# Altium project PCB_Project.PrjPcb
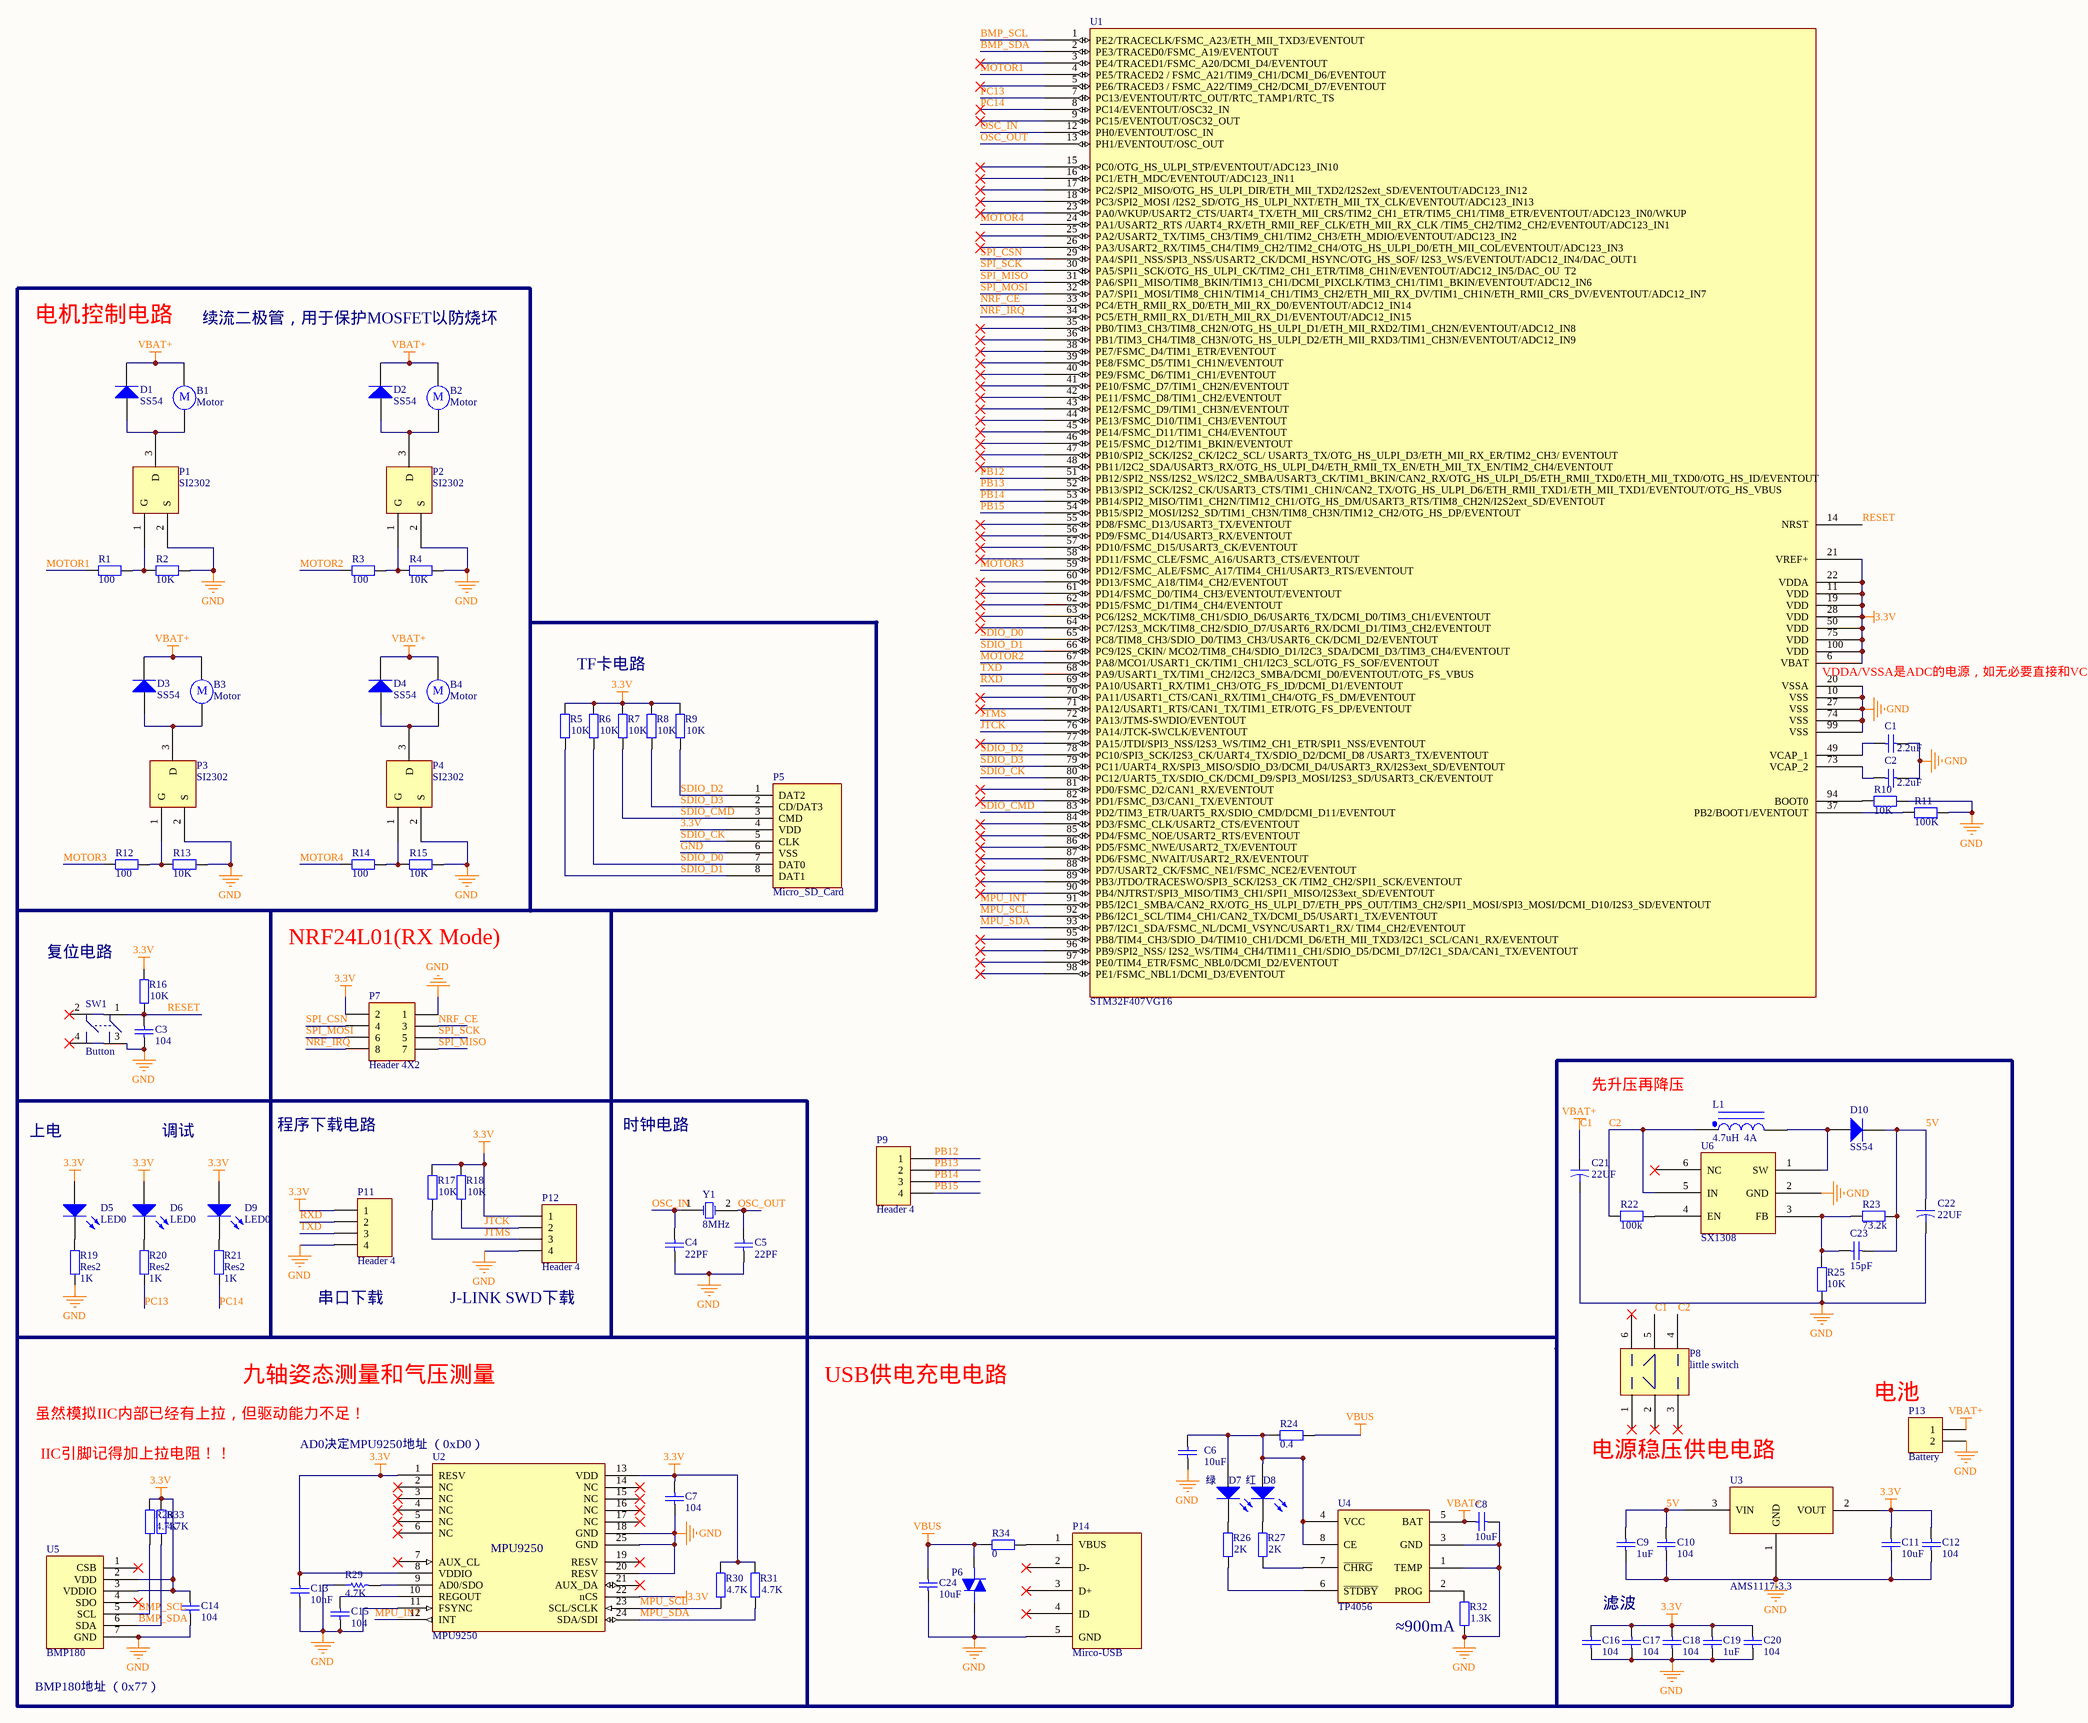
[diagram p0: Sheet1.SchDoc]
1 sheet, 94 parts. Net scope: global (net labels, ports and power ports of the same name join across sheets).
Board files: PCB1.PcbDoc, PCB3.PcbDoc

## Sheet Sheet1.SchDoc
size A2

### Parts
B1  Motor  [BAT-2]
B2  Motor  [BAT-2]
B3  Motor  [BAT-2]
B4  Motor  [BAT-2]
C1  value 2.2uF  [0603]  (hidden comment: Cap)
C2  value 2.2uF  [0603]  (hidden comment: Cap)
C3  value 104  [0603]  (hidden comment: Cap)
C4  value 22PF  [0603]  (hidden comment: Cap)
C5  value 22PF  [0603]  (hidden comment: Cap)
C6  value 10uF  [0603]  (hidden comment: Cap)
C7  value 104  [0603]  (hidden comment: Cap)
C8  value 10uF  [0603]  (hidden comment: Cap)
C9  value 1uF  [0603]  (hidden comment: Cap)
C10  value 104  [0603]  (hidden comment: Cap)
C11  value 10uF  [0603]  (hidden comment: Cap)
C12  value 104  [0603]  (hidden comment: Cap)
C13  value 10nF  [0603]  (hidden comment: Cap)
C14  value 104  [0603]  (hidden comment: Cap)
C15  value 104  [0603]  (hidden comment: Cap)
C16  value 104  [0603]  (hidden comment: Cap)
C17  value 104  [0603]  (hidden comment: Cap)
C18  value 104  [0603]  (hidden comment: Cap)
C19  value 1uF  [0603]  (hidden comment: Cap)
C20  value 104  [0603]  (hidden comment: Cap)
C21  value 22UF  [0603]  (hidden comment: Cap2)
C22  value 22UF  [0603]  (hidden comment: Cap2)
C23  value 15pF  [0603]  (hidden comment: Cap)
C24  value 10uF  [0603]  (hidden comment: Cap)
D1  SS54  [DO-214AA/SMB]
D2  SS54  [DO-214AA/SMB]
D3  SS54  [DO-214AA/SMB]
D4  SS54  [DO-214AA/SMB]
D5  LED0  [0603-LED]
D6  LED0  [0603-LED]
D7  绿  [0603-LED]
D8  红  [0603-LED]
D9  LED0  [0603-LED]
D10  SS54  [DO-214AA/SMB]
L1  value 4.7uH  4A  [0603]  (hidden comment: Inductor Iron Dot)
P1  SI2302  [SOT-23]
P2  SI2302  [SOT-23]
P3  SI2302  [SOT-23]
P4  SI2302  [SOT-23]
P5  Micro_SD_Card  [Micro SD Card]
P6  PESD5V0ST1BA  [0603]  (value not drawn)
P7  Header 4X2  [HDR2X4]
P8  little switch  [little switch]
P9  Header 4  [HDR1X4]
P11  Header 4  [HDR1X4]
P12  Header 4  [HDR1X4]
P13  Battery  [HDR1X2]
P14  Mirco-USB  [microUSB2]
R1  value 100  [0603]  (hidden comment: Res2)
R2  value 10K  [0603]  (hidden comment: Res2)
R3  value 100  [0603]  (hidden comment: Res2)
R4  value 10K  [0603]  (hidden comment: Res2)
R5  value 10K  [0603]  (hidden comment: Res2)
R6  value 10K  [0603]  (hidden comment: Res2)
R7  value 10K  [0603]  (hidden comment: Res2)
R8  value 10K  [0603]  (hidden comment: Res2)
R9  value 10K  [0603]  (hidden comment: Res2)
R10  value 10K  [0603]  (hidden comment: Res2)
R11  value 100K  [0603]  (hidden comment: Res2)
R12  value 100  [0603]  (hidden comment: Res2)
R13  value 10K  [0603]  (hidden comment: Res2)
R14  value 100  [0603]  (hidden comment: Res2)
R15  value 10K  [0603]  (hidden comment: Res2)
R16  value 10K  [0603]  (hidden comment: Res2)
R17  value 10K  [0603]  (hidden comment: Res2)
R18  value 10K  [0603]  (hidden comment: Res2)
R19  Res2  value 1K  [0603]
R20  Res2  value 1K  [0603]
R21  Res2  value 1K  [0603]
R22  value 100k  [0603]  (hidden comment: Res2)
R23  value 73.2k  [0603]  (hidden comment: Res2)
R24  value 0.4  [0603]  (hidden comment: Res2)
R25  value 10K  [0603]  (hidden comment: Res2)
R26  value 2K  [0603]  (hidden comment: Res2)
R27  value 2K  [0603]  (hidden comment: Res2)
R28  value 4.7K  [0603]  (hidden comment: Res2)
R29  value 4.7K  [0603]  (hidden comment: Res1)
R30  value 4.7K  [0603]  (hidden comment: Res2)
R31  value 4.7K  [0603]  (hidden comment: Res2)
R32  value 1.3K  [0603]  (hidden comment: Res2)
R33  value 4.7K  [0603]  (hidden comment: Res2)
R34  value 0  [0603]  (hidden comment: Res2)
SW1  Button  [SMD,5.1x5.1mm - duplicate]
U1  STM32F407VGT6  [LQFP-100]
U2  MPU9250  [QFN24]
U3  AMS1117-3.3  [SOT-223]
U4  TP4056  [SOIC-8/SOP-8]
U5  BMP180  [BMP180]
U6  SX1308  [sot-23-6]
Y1  8MHz  [LC-HC-49S]

### Nets
3.3V: C7.1 C11.2 C12.2 C13.1 C14.1 C16.2 C17.2 C18.2 C19.2 C20.2 D5.1(A) D6.1(A) D9.1(A) P5.4(VDD) P7.2 P11.1 P12.1 R5.2 R6.2 R7.2 R8.2 R9.2 R16.2 R17.2 R18.2 R28.2 R30.2 R31.2 R33.2 U1.6(VBAT) U1.11(VDD) U1.19(VDD) U1.21(VREF+) U1.22(VDDA) U1.28(VDD) U1.50(VDD) U1.75(VDD) U1.100(VDD) U2.1(RESV) U2.8(VDDIO) U2.13(VDD) U2.22(nCS) U3.2(VOUT) U5.2(VDD) U5.3(VDDIO)
C1: B1.1 B2.1 B3.1 B4.1 C8.1 C21.1 D1.2(K) D2.2(K) D3.2(K) D4.2(K) P8.5 P13.1 U4.5(BAT)  [also labelled VBAT+]
GND: C1.2 C2.2 C3.1 C4.1 C5.1 C6.1 C7.2 C8.2 C9.1 C10.1 C11.1 C12.1 C13.2 C14.2 C15.2 C16.1 C17.1 C18.1 C19.1 C20.1 C21.2 C22.2 C24.1 P1.2(S) P2.2(S) P3.2(S) P4.2(S) P5.6(VSS) P6.2(M2) P7.1 P11.4 P12.4 P13.2 P14.5(GND) R2.1 R4.1 R10.1 R11.1 R13.1 R15.1 R19.1 R25.1 R29.1 R32.1 SW1.3 U1.10(VSS) U1.20(VSSA) U1.27(VSS) U1.74(VSS) U1.99(VSS) U2.11(FSYNC) U2.18(GND) U2.20(RESV) U2.25(GND) U3.1(GND) U4.1(TEMP) U4.3(GND) U5.7(GND) U6.2(GND)
VBUS: C24.2 P6.1(M1) R24.1 R34.2
5V: C9.2 C10.2 C22.1 C23.1 D10.2(K) R23.1 U3.3(VIN)
BMP_SCL: R28.1 U1.1(PE2/TRACECLK/FSMC_A23/ETH_MII_TXD3/EVENTOUT) U5.5(SCL)
BMP_SDA: R33.1 U1.2(PE3/TRACED0/FSMC_A19/EVENTOUT) U5.6(SDA)
C2: L1.1 P8.4 R22.2 U6.5(IN)
JTCK: P12.2 R18.1 U1.76(PA14/JTCK-SWCLK/EVENTOUT)
JTMS: P12.3 R17.1 U1.72(PA13/JTMS-SWDIO/EVENTOUT)
MOTOR1: R1.2 U1.4(PE5/TRACED2_/_FSMC_A21/TIM9_CH1/DCMI_D6/EVENTOUT)
MOTOR2: R3.2 U1.67(PA8/MCO1/USART1_CK/TIM1_CH1/I2C3_SCL/OTG_FS_SOF/EVENTOUT)
MOTOR3: R12.2 U1.59(PD12/FSMC_ALE/FSMC_A17/TIM4_CH1/USART3_RTS/EVENTOUT)
MOTOR4: R14.2 U1.24(PA1/USART2_RTS_/UART4_RX/ETH_RMII_REF_CLK/ETH_MII_RX_CLK_/TIM5_CH2/TIM2_CH2/EVENTOUT/ADC123_IN1)
MPU_INT: U1.91(PB5/I2C1_SMBA/CAN2_RX/OTG_HS_ULPI_D7/ETH_PPS_OUT/TIM3_CH2/SPI1_MOSI/SPI3_MOSI/DCMI_D10/I2S3_SD/EVENTOUT) U2.12(INT)
MPU_SCL: R30.1 U1.92(PB6/I2C1_SCL/TIM4_CH1/CAN2_TX/DCMI_D5/USART1_TX/EVENTOUT) U2.23(SCL/SCLK)
MPU_SDA: R31.1 U1.93(PB7/I2C1_SDA/FSMC_NL/DCMI_VSYNC/USART1_RX/_TIM4_CH2/EVENTOUT) U2.24(SDA/SDI)
NRF_CE: P7.3 U1.33(PC4/ETH_RMII_RX_D0/ETH_MII_RX_D0/EVENTOUT/ADC12_IN14)
NRF_IRQ: P7.8 U1.34(PC5/ETH_RMII_RX_D1/ETH_MII_RX_D1/EVENTOUT/ADC12_IN15)
OSC_IN: C4.2 U1.12(PH0/EVENTOUT/OSC_IN) Y1.1(OSC1)
OSC_OUT: C5.2 U1.13(PH1/EVENTOUT/OSC_OUT) Y1.2(OSC2)
PB12: P9.1 U1.51(PB12/SPI2_NSS/I2S2_WS/I2C2_SMBA/USART3_CK/TIM1_BKIN/CAN2_RX/OTG_HS_ULPI_D5/ETH_RMII_TXD0/ETH_MII_TXD0/OTG_HS_ID/EVENTOUT)
PB13: P9.2 U1.52(PB13/SPI2_SCK/I2S2_CK/USART3_CTS/TIM1_CH1N/CAN2_TX/OTG_HS_ULPI_D6/ETH_RMII_TXD1/ETH_MII_TXD1/EVENTOUT/OTG_HS_VBUS)
PB14: P9.3 U1.53(PB14/SPI2_MISO/TIM1_CH2N/TIM12_CH1/OTG_HS_DM/USART3_RTS/TIM8_CH2N/I2S2ext_SD/EVENTOUT)
PB15: P9.4 U1.54(PB15/SPI2_MOSI/I2S2_SD/TIM1_CH3N/TIM8_CH3N/TIM12_CH2/OTG_HS_DP/EVENTOUT)
PC13: R20.1 U1.7(PC13/EVENTOUT/RTC_OUT/RTC_TAMP1/RTC_TS)
PC14: R21.1 U1.8(PC14/EVENTOUT/OSC32_IN)
RESET: C3.2 R16.1 SW1.1 U1.14(NRST)
RXD: P11.2 U1.69(PA10/USART1_RX/TIM1_CH3/OTG_FS_ID/DCMI_D1/EVENTOUT)
SDIO_CK: P5.5(CLK) U1.80(PC12/UART5_TX/SDIO_CK/DCMI_D9/SPI3_MOSI/I2S3_SD/USART3_CK/EVENTOUT)
SDIO_CMD: P5.3(CMD) R7.1 U1.83(PD2/TIM3_ETR/UART5_RX/SDIO_CMD/DCMI_D11/EVENTOUT)
SDIO_D0: P5.7(DAT0) R6.1 U1.65(PC8/TIM8_CH3/SDIO_D0/TIM3_CH3/USART6_CK/DCMI_D2/EVENTOUT)
SDIO_D1: P5.8(DAT1) R5.1 U1.66(PC9/I2S_CKIN/_MCO2/TIM8_CH4/SDIO_D1/I2C3_SDA/DCMI_D3/TIM3_CH4/EVENTOUT)
SDIO_D2: P5.1(DAT2) R9.1 U1.78(PC10/SPI3_SCK/I2S3_CK/UART4_TX/SDIO_D2/DCMI_D8_/USART3_TX/EVENTOUT)
SDIO_D3: P5.2(CD/DAT3) R8.1 U1.79(PC11/UART4_RX/SPI3_MISO/SDIO_D3/DCMI_D4/USART3_RX/I2S3ext_SD/EVENTOUT)
SPI_CSN: P7.4 U1.29(PA4/SPI1_NSS/SPI3_NSS/USART2_CK/DCMI_HSYNC/OTG_HS_SOF/_I2S3_WS/EVENTOUT/ADC12_IN4/DAC_OUT1)
SPI_MISO: P7.7 U1.31(PA6/SPI1_MISO/TIM8_BKIN/TIM13_CH1/DCMI_PIXCLK/TIM3_CH1/TIM1_BKIN/EVENTOUT/ADC12_IN6)
SPI_MOSI: P7.6 U1.32(PA7/SPI1_MOSI/TIM8_CH1N/TIM14_CH1/TIM3_CH2/ETH_MII_RX_DV/TIM1_CH1N/ETH_RMII_CRS_DV/EVENTOUT/ADC12_IN7)
SPI_SCK: P7.5 U1.30(PA5/SPI1_SCK/OTG_HS_ULPI_CK/TIM2_CH1_ETR/TIM8_CH1N/EVENTOUT/ADC12_IN5/DAC_OU__T2)
TXD: P11.3 U1.68(PA9/USART1_TX/TIM1_CH2/I2C3_SMBA/DCMI_D0/EVENTOUT/OTG_FS_VBUS)
NetB1_2: B1.2 D1.1(A) P1.3(D)
NetB2_2: B2.2 D2.1(A) P2.3(D)
NetB3_2: B3.2 D3.1(A) P3.3(D)
NetB4_2: B4.2 D4.1(A) P4.3(D)
NetC1_1: C1.1 U1.49(VCAP_1)
NetC2_1: C2.1 U1.73(VCAP_2)
NetC6_2: C6.2 D7.1(A) D8.1(A) R24.2 U4.4(VCC) U4.8(CE)
NetC15_1: C15.1 U2.10(REGOUT)
NetC23_2: C23.2 R23.2 R25.2 U6.3(FB)
NetD5_2: D5.2(K) R19.2
NetD6_2: D6.2(K) R20.2
NetD7_2: D7.2(K) R26.2
NetD8_2: D8.2(K) R27.2
NetD9_2: D9.2(K) R21.2
NetD10_1: D10.1(A) L1.2 U6.1(SW)
NetP1_1: P1.1(G) R1.1 R2.2
NetP2_1: P2.1(G) R3.1 R4.2
NetP3_1: P3.1(G) R12.1 R13.2
NetP4_1: P4.1(G) R14.1 R15.2
NetP14_1: P14.1(VBUS) R34.1
NetR10_2: R10.2 U1.94(BOOT0)
NetR11_2: R11.2 U1.37(PB2/BOOT1/EVENTOUT)
NetR22_1: R22.1 U6.4(EN)
NetR26_1: R26.1 U4.6(~{STDBY})
NetR27_1: R27.1 U4.7(~{CHRG})
NetR29_2: R29.2 U2.9(AD0/SDO)
NetR32_2: R32.2 U4.2(PROG)

Not connected (* = marked no-connect by the designer): P8 1(8)* 2(9)* 3(10)* 6(13)*; P14 2(D-)* 3(D+)* 4(ID)*; SW1 2* 4*; U1 3(PE4/TRACED1/FSMC_A20/DCMI_D4/EVENTOUT)* 5(PE6/TRACED3_/_FSMC_A22/TIM9_CH2/DCMI_D7/EVENTOUT)* 9(PC15/EVENTOUT/OSC32_OUT)* 15(PC0/OTG_HS_ULPI_STP/EVENTOUT/ADC123_IN10)* 16(PC1/ETH_MDC/EVENTOUT/ADC123_IN11)* 17(PC2/SPI2_MISO/OTG_HS_ULPI_DIR/ETH_MII_TXD2/I2S2ext_SD/EVENTOUT/ADC123_IN12)* 18(PC3/SPI2_MOSI_/I2S2_SD/OTG_HS_ULPI_NXT/ETH_MII_TX_CLK/EVENTOUT/ADC123_IN13)* 23(PA0/WKUP/USART2_CTS/UART4_TX/ETH_MII_CRS/TIM2_CH1_ETR/TIM5_CH1/TIM8_ETR/EVENTOUT/ADC123_IN0/WKUP)* 25(PA2/USART2_TX/TIM5_CH3/TIM9_CH1/TIM2_CH3/ETH_MDIO/EVENTOUT/ADC123_IN2)* 26(PA3/USART2_RX/TIM5_CH4/TIM9_CH2/TIM2_CH4/OTG_HS_ULPI_D0/ETH_MII_COL/EVENTOUT/ADC123_IN3)* 35(PB0/TIM3_CH3/TIM8_CH2N/OTG_HS_ULPI_D1/ETH_MII_RXD2/TIM1_CH2N/EVENTOUT/ADC12_IN8)* 36(PB1/TIM3_CH4/TIM8_CH3N/OTG_HS_ULPI_D2/ETH_MII_RXD3/TIM1_CH3N/EVENTOUT/ADC12_IN9)* 38(PE7/FSMC_D4/TIM1_ETR/EVENTOUT)* 39(PE8/FSMC_D5/TIM1_CH1N/EVENTOUT)* 40(PE9/FSMC_D6/TIM1_CH1/EVENTOUT)* 41(PE10/FSMC_D7/TIM1_CH2N/EVENTOUT)* 42(PE11/FSMC_D8/TIM1_CH2/EVENTOUT)* 43(PE12/FSMC_D9/TIM1_CH3N/EVENTOUT)* 44(PE13/FSMC_D10/TIM1_CH3/EVENTOUT)* 45(PE14/FSMC_D11/TIM1_CH4/EVENTOUT)* 46(PE15/FSMC_D12/TIM1_BKIN/EVENTOUT)* 47(PB10/SPI2_SCK/I2S2_CK/I2C2_SCL/_USART3_TX/OTG_HS_ULPI_D3/ETH_MII_RX_ER/TIM2_CH3/_EVENTOUT)* 48(PB11/I2C2_SDA/USART3_RX/OTG_HS_ULPI_D4/ETH_RMII_TX_EN/ETH_MII_TX_EN/TIM2_CH4/EVENTOUT)* 55(PD8/FSMC_D13/USART3_TX/EVENTOUT)* 56(PD9/FSMC_D14/USART3_RX/EVENTOUT)* 57(PD10/FSMC_D15/USART3_CK/EVENTOUT)* 58(PD11/FSMC_CLE/FSMC_A16/USART3_CTS/EVENTOUT)* 60(PD13/FSMC_A18/TIM4_CH2/EVENTOUT)* 61(PD14/FSMC_D0/TIM4_CH3/EVENTOUT/EVENTOUT)* 62(PD15/FSMC_D1/TIM4_CH4/EVENTOUT)* 63(PC6/I2S2_MCK/TIM8_CH1/SDIO_D6/USART6_TX/DCMI_D0/TIM3_CH1/EVENTOUT)* 64(PC7/I2S3_MCK/TIM8_CH2/SDIO_D7/USART6_RX/DCMI_D1/TIM3_CH2/EVENTOUT)* 70(PA11/USART1_CTS/CAN1_RX/TIM1_CH4/OTG_FS_DM/EVENTOUT)* 71(PA12/USART1_RTS/CAN1_TX/TIM1_ETR/OTG_FS_DP/EVENTOUT)* 77(PA15/JTDI/SPI3_NSS/I2S3_WS/TIM2_CH1_ETR/SPI1_NSS/EVENTOUT)* 81(PD0/FSMC_D2/CAN1_RX/EVENTOUT)* 82(PD1/FSMC_D3/CAN1_TX/EVENTOUT)* 84(PD3/FSMC_CLK/USART2_CTS/EVENTOUT)* 85(PD4/FSMC_NOE/USART2_RTS/EVENTOUT)* 86(PD5/FSMC_NWE/USART2_TX/EVENTOUT)* 87(PD6/FSMC_NWAIT/USART2_RX/EVENTOUT)* 88(PD7/USART2_CK/FSMC_NE1/FSMC_NCE2/EVENTOUT)* 89(PB3/JTDO/TRACESWO/SPI3_SCK/I2S3_CK_/TIM2_CH2/SPI1_SCK/EVENTOUT)* 90(PB4/NJTRST/SPI3_MISO/TIM3_CH1/SPI1_MISO/I2S3ext_SD/EVENTOUT)* 95(PB8/TIM4_CH3/SDIO_D4/TIM10_CH1/DCMI_D6/ETH_MII_TXD3/I2C1_SCL/CAN1_RX/EVENTOUT)* 96(PB9/SPI2_NSS/_I2S2_WS/TIM4_CH4/TIM11_CH1/SDIO_D5/DCMI_D7/I2C1_SDA/CAN1_TX/EVENTOUT)* 97(PE0/TIM4_ETR/FSMC_NBL0/DCMI_D2/EVENTOUT)* 98(PE1/FSMC_NBL1/DCMI_D3/EVENTOUT)*; U2 2(NC)* 3(NC)* 4(NC)* 5(NC)* 6(NC)* 7(AUX_CL)* 14(NC)* 15(NC)* 16(NC)* 17(NC)* 19(RESV)* 21(AUX_DA)*; U5 1(CSB)* 4(SDO)*; U6 6(NC)*

### Notes on the sheet
- 电机控制电路
- 续流二极管，用于保护MOSFET以防烧坏
- TF卡电路
- (near U1) VDDA/VSSA是ADC的电源，如无必要直接和VCC/GND连接就可以
- 复位电路
- NRF24L01(RX Mode)
- 先升压再降压
- 上电
- 调试
- 程序下载电路
- 时钟电路
- (near P11) 串口下载
- (near P12) J-LINK SWD下载
- 虽然模拟IIC内部已经有上拉，但驱动能力不足！
- 九轴姿态测量和气压测量
- USB供电充电电路
- 电池
- IIC引脚记得加上拉电阻！！
- (near U2) AD0决定MPU9250地址 （0xD0）
- 电源稳压供电电路
- ≈900mA
- 滤波
- (near U5) BMP180地址 （0x77）
- (in symbol Motor) M

### Library data of the parts
B1-B4 = Motor: Motor, General Kind; Published: 24-Mar-1999; LatestRevisionDate: 17-Jul-2002; LatestRevisionNote: Re-released for DXP Platform.; PackageReference: RB5-10.5; Publisher: Altium Limited; PackageDescription: Capacitor (Radial); 2 Leads
C1-C20 C23 C24 = Cap: Capacitor; Published: 8-Jun-2000; LatestRevisionDate: 17-Jul-2002; LatestRevisionNote: Re-released for DXP Platform.; PackageReference: RAD-0.3; Publisher: Altium Limited; PackageDescription: Radial Cap, Thru-Hole; 2 Leads; 0.3 in Pin Spacing
C21 C22 = Cap2: Capacitor; Published: 23-Sep-2002; PackageReference: CAPR5-4X5; Publisher: Altium Limited; PackageDescription: Capacitor; 2 Leads
D1-D4 D10 = Diode: Default Diode; Published: 8-Jun-2000; LatestRevisionDate: 17-Jul-2002; LatestRevisionNote: Re-released for DXP Platform.; PackageVersion: Sep-1996; PackageReference: SMC; Publisher: Altium Limited; PackageDescription: DO-214-AB/SMC; 2 C-Bend Leads; Body 7.9 x 5.9 mm, inc. leads (LxW); Code_JEDEC: DO-214-AB
D5-D9 = LED0: Typical INFRARED GaAs LED; Published: 8-Jun-2000; LatestRevisionDate: 08-Jul-2005; LatestRevisionNote: Mech Layer 1 removed.; PackageReference: LED-0; Publisher: Altium Limited; PackageDescription: LED; 2 Leads
L1 = Inductor Iron Dot: Magnetic-Core Inductor with Winding Polarity Marking; Published: 24-Mar-1999; LatestRevisionDate: 17-Jul-2002; LatestRevisionNote: Re-released for DXP Platform.; PackageReference: DIODE_SMC; Publisher: Altium Limited; PackageDescription: Diode; 2 Leads
P1-P4 = SI2302: MOSFET
P6 = esd9b5.0st5g
P7 = Header 4X2: Header, 4-Pin, Dual row; LatestRevisionDate: 17-Jul-2002; LatestRevisionNote: Re-released for DXP Platform.; Publisher: Altium Limited
P9 P11 P12 = Header 4: Header, 4-Pin; LatestRevisionDate: 17-Jul-2002; LatestRevisionNote: Re-released for DXP Platform.; Publisher: Altium Limited
P13 = Header 2: Header, 2-Pin; LatestRevisionDate: 17-Jul-2002; LatestRevisionNote: Re-released for DXP Platform.; Publisher: Altium Limited
P14 = Mirco-USB: USB
R1-R28 R30-R34 = Res2: Resistor; Published: 8-Jun-2000; LatestRevisionDate: 17-Jul-2002; LatestRevisionNote: Re-released for DXP Platform.; PackageReference: AXIAL-0.4; Publisher: Altium Limited; PackageDescription: Axial Device, Thru-Hole; 2 Leads; 0.4 in Pin Spacing
R29 = Res1: Resistor; Published: 8-Jun-2000; LatestRevisionDate: 17-Jul-2002; LatestRevisionNote: Re-released for DXP Platform.; PackageReference: AXIAL-0.3; Publisher: Altium Limited; PackageDescription: Axial Device, Thru-Hole; 2 Leads; 0.3 in Pin Spacing
U1 = STM32F407VGT6: ST MCU
U2 = MPU9250: IMU
U3 = AMS1117-3.3: 5V->3.3V
U4 = TP4056: Battery Charge IC
U5 = BMP180: atmospheric pressure sensor
Y1 = XTAL: Crystal Oscillator; Published: 8-Jun-2000; LatestRevisionDate: 17-Jul-2002; LatestRevisionNote: Re-released for DXP Platform.; PackageReference: R38; Publisher: Altium Limited; PackageDescription: Crystal, Thru-Hole; 2 Leads; Body 3.1 x 8.2 mm (Dia.xH)